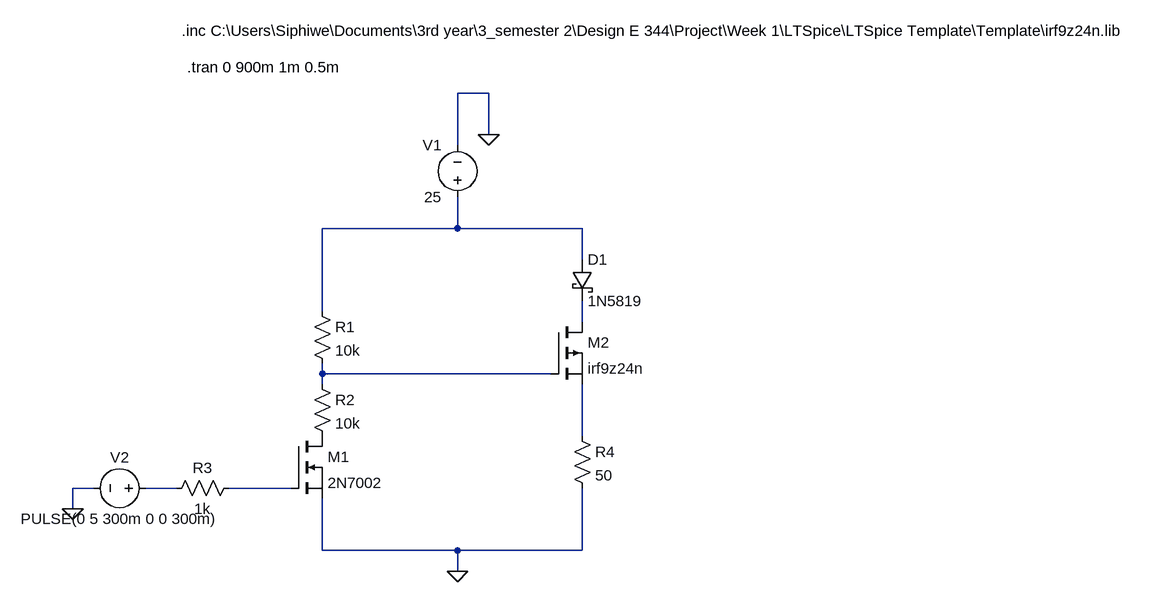
[diagram p0: schematic Draft1.asc]
Draft1.asc, the LTspice schematic file:
Version 4
SHEET 1 1412 728
WIRE 256 -48 208 -48
WIRE 256 16 256 -48
WIRE 208 32 208 -48
WIRE 208 160 208 112
WIRE 208 160 0 160
WIRE 400 160 208 160
WIRE 400 208 400 160
WIRE 0 288 0 160
WIRE 400 304 400 272
WIRE 0 384 0 368
WIRE 352 384 0 384
WIRE 0 400 0 384
WIRE 400 480 400 400
WIRE -352 560 -384 560
WIRE -224 560 -272 560
WIRE -48 560 -144 560
WIRE -384 592 -384 560
WIRE 0 656 0 576
WIRE 208 656 0 656
WIRE 400 656 400 560
WIRE 400 656 208 656
WIRE 208 688 208 656
FLAG 208 688 0
FLAG 256 16 0
FLAG -384 592 0
SYMBOL nmos -48 480 R0
SYMATTR InstName M1
SYMATTR Value 2N7002
SYMBOL pmos 352 304 R0
SYMATTR InstName M2
SYMATTR Value irf9z24n
SYMBOL schottky 384 208 R0
SYMATTR InstName D1
SYMATTR Value 1N5819
SYMATTR Description Diode
SYMATTR Type diode
SYMBOL res -16 272 R0
SYMATTR InstName R1
SYMATTR Value 10k
SYMBOL res -16 384 R0
SYMATTR InstName R2
SYMATTR Value 10k
SYMBOL res -128 544 R90
WINDOW 0 0 56 VBottom 2
WINDOW 3 32 56 VTop 2
SYMATTR InstName R3
SYMATTR Value 1k
SYMBOL res 384 464 R0
SYMATTR InstName R4
SYMATTR Value 50
SYMBOL voltage 208 128 R180
WINDOW 0 24 96 Left 2
WINDOW 3 24 16 Left 2
WINDOW 123 0 0 Left 0
WINDOW 39 0 0 Left 0
SYMATTR InstName V1
SYMATTR Value 25
SYMBOL voltage -256 560 R90
WINDOW 0 -32 56 VBottom 2
WINDOW 3 32 56 VTop 2
WINDOW 123 0 0 Left 0
WINDOW 39 0 0 Left 0
SYMATTR InstName V2
SYMATTR Value PULSE(0 5 300m 0 0 300m)
TEXT -216 -144 Left 2 !.inc C:\\Users\\Siphiwe\\Documents\\3rd year\\3_semester 2\\Design E 344\\Project\\Week 1\\LTSpice\\LTSpice Template\\Template\\irf9z24n.lib
TEXT -208 -88 Left 2 !.tran 0 900m 1m 0.5m

The netlist it stands for:
* Draft1.asc
M1 P001 N006 0 0 2N7002
M2 N002 N003 N004 N004 irf9z24n
D1 N001 N002 1N5819
R1 N001 N003 10k
R2 N003 P001 10k
R3 N006 N005 1k
R4 N004 0 50
V1 N001 0 25
V2 N005 0 PULSE(0 5 300m 0 0 300m)
.model D D
.lib standard.dio
.model NMOS NMOS
.model PMOS PMOS
.lib standard.mos
.inc C:\Users\Siphiwe\Documents\3rd year\3_semester 2\Design E 344\Project\Week 1\LTSpice\LTSpice Template\Template\irf9z24n.lib
.tran 0 900m 1m 0.5m
.backanno
.end